# Altium project PulseOx_0.PrjPcb
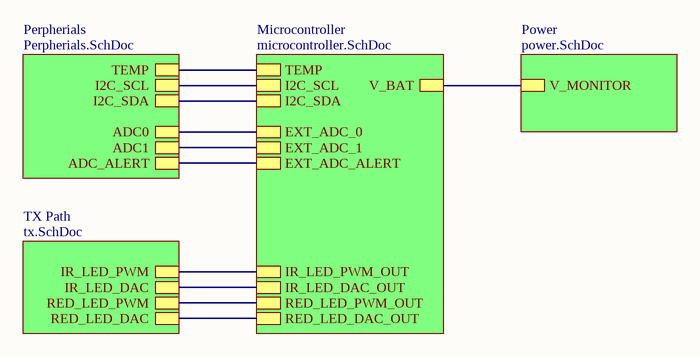
[diagram p0: TopLevel.SchDoc]
5 sheets, 63 parts. Net scope: hierarchical (ports join the sheet entries above them; power ports are global).
Board file: PulseOx_0_PCB.PcbDoc
Sheets:
  TopLevel.SchDoc
    Microcontroller = microcontroller.SchDoc
    Perpherials = Perpherials.SchDoc
    Power = power.SchDoc
    TX Path = tx.SchDoc

## Sheet TopLevel.SchDoc: Top Sheet V0
size Letter; Organization: PulseOut COVID; Address1: By: C. Miller; Address2: By. N. Petrunyak; Address3: pulseoutcovid.com; DocumentNumber: 1; Revision: 0; SheetNumber: 1; SheetTotal: 5

### Sub-sheets
Microcontroller = microcontroller.SchDoc: TEMP, I2C_SCL, IR_LED_PWM_OUT, RED_LED_PWM_OUT, I2C_SDA, V_BAT, EXT_ADC_0, EXT_ADC_1, EXT_ADC_ALERT, IR_LED_DAC_OUT, RED_LED_DAC_OUT
Perpherials = Perpherials.SchDoc: TEMP, I2C_SCL, I2C_SDA, ADC0, ADC1, ADC_ALERT
Power = power.SchDoc: V_MONITOR
TX Path = tx.SchDoc: IR_LED_DAC, RED_LED_DAC, IR_LED_PWM, RED_LED_PWM

### Nets
IR_DAC_OUT: sheet Microcontroller/IR_LED_DAC_OUT, sheet TX Path/IR_LED_DAC
IR_PWM_OUT: sheet Microcontroller/IR_LED_PWM_OUT, sheet TX Path/IR_LED_PWM
RED_DAC_OUT: sheet Microcontroller/RED_LED_DAC_OUT, sheet TX Path/RED_LED_DAC
RED_PWM_OUT: sheet Microcontroller/RED_LED_PWM_OUT, sheet TX Path/RED_LED_PWM
NetC15_2: sheet Microcontroller/TEMP, sheet Perpherials/TEMP
NetR2_1: sheet Microcontroller/EXT_ADC_0, sheet Perpherials/ADC0
NetR6_1: sheet Microcontroller/EXT_ADC_1, sheet Perpherials/ADC1
NetR22_2: sheet Microcontroller/EXT_ADC_ALERT, sheet Perpherials/ADC_ALERT
NetR23_2: sheet Microcontroller/I2C_SDA, sheet Perpherials/I2C_SDA
NetR24_2: sheet Microcontroller/I2C_SCL, sheet Perpherials/I2C_SCL
NetU1_4: sheet Microcontroller/V_BAT, sheet Power/V_MONITOR

### Notes on the sheet
- Title
- Size:
- Date:
- Letter
- Number:
- Time:
- Revision:
- Sheet
- of
- File:

## Sheet microcontroller.SchDoc: Microcontroller, Indicator, and RX
size Letter; Organization: PulseOut COVID; Address1: By: C. Miller; Address2: pulseoutcovid.com; DocumentNumber: 1; Revision: 0; SheetNumber: 2; SheetTotal: 5
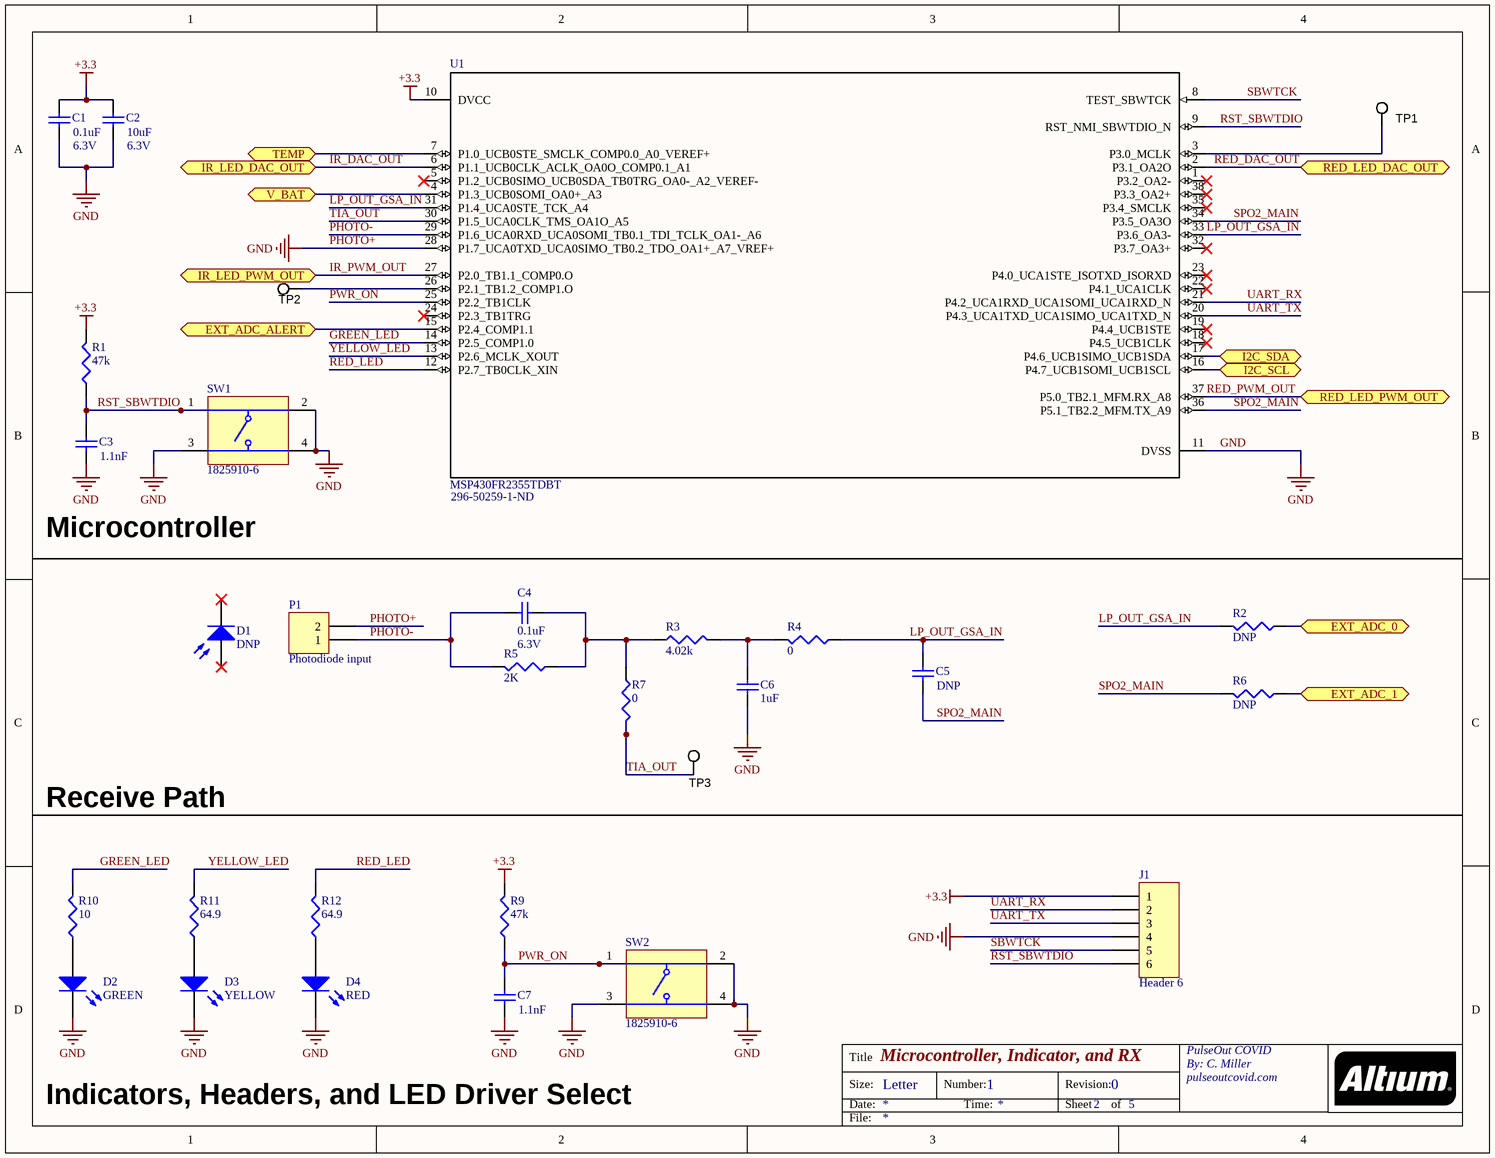
[diagram p1: microcontroller.SchDoc]

### Parts
C1  value 0.1uF  Voltage: 6.3V  [1608[0603]]  (hidden comment: Cap Semi)
C2  value 10uF  Voltage: 6.3V  [1608[0603]]  (hidden comment: Cap Semi)
C3  value 1.1nF  [0603]  (hidden comment: Cap Semi)
C4  value 0.1uF  Voltage: 6.3V  [1608[0603]]  (hidden comment: Cap Semi)
C5  value DNP  [0603]  (hidden comment: Cap Semi)
C6  value 1uF  [1608[0603]]  (hidden comment: Cap Semi)
C7  value 1.1nF  [0603]  (hidden comment: Cap Semi)
D1  DNP  [PIN2]
D2  GREEN  [3.5X2.8X1.9]
D3  YELLOW  [3.5X2.8X1.9]
D4  RED  [3.5X2.8X1.9]
J1  Header 6  [HDR1X6]
P1  Photodiode input  [HDR1X2]
R1  value 47k  [J1-0603]  (hidden comment: Res3)
R2  value DNP  [J1-0603]  (hidden comment: Res3)
R3  value 4.02k  [J1-0603]  (hidden comment: Res3)
R4  value 0  [J1-0603]  (hidden comment: Res3)
R5  value 2K  [J1-0603]  (hidden comment: Res3)
R6  value DNP  [J1-0603]  (hidden comment: Res3)
R7  value 0  [J1-0603]  (hidden comment: Res3)
R9  value 47k  [J1-0603]  (hidden comment: Res3)
R10  value 10  [J1-0603]  (hidden comment: Res3)
R11  value 64.9  [J1-0603]  (hidden comment: Res3)
R12  value 64.9  [J1-0603]  (hidden comment: Res3)
SW1  1825910-6  [TECO-1825910-6_V]
SW2  1825910-6  [TECO-1825910-6_V]
TP1  5002  [Keystone5002]  (value not drawn)
TP2  5002  [Keystone5002]  (value not drawn)
TP3  5002  [Keystone5002]  (value not drawn)
U1  MSP430FR2355TDBT  DigiKey: 296-50259-1-ND  [DBT0038A_N]

### Ports
EXT_ADC_0 (bidir), EXT_ADC_1 (bidir), EXT_ADC_ALERT (bidir), I2C_SCL (bidir), I2C_SDA (bidir), IR_LED_DAC_OUT (bidir), IR_LED_PWM_OUT (bidir), RED_LED_DAC_OUT (bidir), RED_LED_PWM_OUT (bidir), TEMP (bidir), V_BAT (bidir)

### Nets
+3.3: C1.2 C2.2 J1.1 R1.2 R9.2 U1.10(DVCC)
GND: C1.1 C2.1 C3.1 C6.2 C7.1 D2.2(K) D3.2(K) D4.2(K) J1.4 P1.2 SW1.2 SW1.3 SW1.4 SW2.2 SW2.3 SW2.4 U1.11(DVSS) U1.28(P1.7_UCA0TXD_UCA0SIMO_TB0.2_TDO_OA1+_A7_VREF+)  [also labelled PHOTO+]
GREEN_LED: R10.2 U1.14(P2.5_COMP1.0)
IR_DAC_OUT: U1.6(P1.1_UCB0CLK_ACLK_OA0O_COMP0.1_A1) ; port IR_LED_DAC_OUT
IR_PWM_OUT: U1.27(P2.0_TB1.1_COMP0.O) ; port IR_LED_PWM_OUT
LP_OUT_GSA_IN: C5.2 R2.2 R4.1 U1.31(P1.4_UCA0STE_TCK_A4) U1.33(P3.6_OA3-)
PHOTO-: C4.2 P1.1 R5.2 U1.29(P1.6_UCA0RXD_UCA0SOMI_TB0.1_TDI_TCLK_OA1-_A6)
PWR_ON: C7.2 R9.1 SW2.1 U1.25(P2.2_TB1CLK)
RED_DAC_OUT: U1.2(P3.1_OA2O) ; port RED_LED_DAC_OUT
RED_LED: R12.2 U1.12(P2.7_TB0CLK_XIN)
RED_PWM_OUT: U1.37(P5.0_TB2.1_MFM.RX_A8) ; port RED_LED_PWM_OUT
RST_SBWTDIO: C3.2 J1.6 R1.1 SW1.1 U1.9(RST_NMI_SBWTDIO_N)
SBWTCK: J1.5 U1.8(TEST_SBWTCK)
SPO2_MAIN: C5.1 R6.2 U1.34(P3.5_OA3O) U1.36(P5.1_TB2.2_MFM.TX_A9)
TIA_OUT: R7.2 TP3.1 U1.30(P1.5_UCA0CLK_TMS_OA1O_A5)
UART_RX: J1.2 U1.21(P4.2_UCA1RXD_UCA1SOMI_UCA1RXD_N)
UART_TX: J1.3 U1.20(P4.3_UCA1TXD_UCA1SIMO_UCA1TXD_N)
YELLOW_LED: R11.2 U1.13(P2.6_MCLK_XOUT)
NetC4_1: C4.1 R3.1 R5.1 R7.1
NetC6_1: C6.1 R3.2 R4.2
NetC15_2: U1.7(P1.0_UCB0STE_SMCLK_COMP0.0_A0_VEREF+) ; port TEMP
NetD2_1: D2.1(A) R10.1
NetD3_1: D3.1(A) R11.1
NetD4_1: D4.1(A) R12.1
NetR2_1: R2.1 ; port EXT_ADC_0
NetR6_1: R6.1 ; port EXT_ADC_1
NetR22_2: U1.15(P2.4_COMP1.1) ; port EXT_ADC_ALERT
NetR23_2: U1.17(P4.6_UCB1SIMO_UCB1SDA) ; port I2C_SDA
NetR24_2: U1.16(P4.7_UCB1SOMI_UCB1SCL) ; port I2C_SCL
NetTP1_1: TP1.1 U1.3(P3.0_MCLK)
NetTP2_1: TP2.1 U1.26(P2.1_TB1.2_COMP1.O)
NetU1_4: U1.4(P1.3_UCB0SOMI_OA0+_A3) ; port V_BAT

Not connected (* = marked no-connect by the designer): D1 1(A)* 2(K)*; U1 1(P3.2_OA2-)* 5(P1.2_UCB0SIMO_UCB0SDA_TB0TRG_OA0-_A2_VEREF-)* 18(P4.5_UCB1CLK)* 19(P4.4_UCB1STE)* 22(P4.1_UCA1CLK)* 23(P4.0_UCA1STE_ISOTXD_ISORXD)* 24(P2.3_TB1TRG)* 32(P3.7_OA3+)* 35(P3.4_SMCLK)* 38(P3.3_OA2+)*

### Notes on the sheet
- Microcontroller
- Receive Path
- Indicators, Headers, and LED Driver Select
- Title
- Size:
- Date:
- Letter
- Number:
- Time:
- Revision:
- Sheet
- of
- File:

### Library data of the parts
C1 C4 = Cap Semi: Capacitor (Semiconductor SIM Model); MPN: 06036C104KAT4A; Manufacturer: AVX Corporation; Published: 8-Jun-2000; LatestRevisionDate: 29-May-2009; LatestRevisionNote: IPC-7351 Footprint Added.; PackageReference: C1206; Publisher: Altium Limited; PackageDescription: Chip Capacitor; DigiKey: 478-06036C104KAT4ACT-ND
C2 = Cap Semi: Capacitor (Semiconductor SIM Model); MPN: JMK107ABJ106KA-T; Manufacturer: Taiyo Yuden; Published: 8-Jun-2000; LatestRevisionDate: 29-May-2009; LatestRevisionNote: IPC-7351 Footprint Added.; PackageReference: C1206; Publisher: Altium Limited; PackageDescription: Chip Capacitor; DigiKey: 587-6012-1-ND
C3 C7 = Cap Semi: Capacitor (Semiconductor SIM Model); MPN: GRM1885C1H112JA01D; Manufacturer: Murata Electronics; Published: 8-Jun-2000; LatestRevisionDate: 29-May-2009; LatestRevisionNote: IPC-7351 Footprint Added.; PackageReference: C1206; Publisher: Altium Limited; PackageDescription: Chip Capacitor; DigiKey: 490-1452-1-ND
C5 = Cap Semi: Capacitor (Semiconductor SIM Model); Published: 8-Jun-2000; LatestRevisionDate: 29-May-2009; LatestRevisionNote: IPC-7351 Footprint Added.; PackageReference: C1206; Publisher: Altium Limited; PackageDescription: Chip Capacitor; DigiKey: DNP
C6 = Cap Semi: Capacitor (Semiconductor SIM Model); MPN: C0603X105J9RAC7867; Manufacturer: KEMET; Published: 8-Jun-2000; LatestRevisionDate: 29-May-2009; LatestRevisionNote: IPC-7351 Footprint Added.; PackageReference: C1206; Publisher: Altium Limited; PackageDescription: Chip Capacitor; DigiKey: 399-17700-1-ND
D1 = Photo Sen: Photosensitive Diode; MPN: BPW34; Manufacturer: OSRAM Opto Semiconductors Inc.; Published: 24-Mar-1999; LatestRevisionDate: 17-Jul-2002; LatestRevisionNote: Re-released for DXP Platform.; PackageReference: PIN2; Publisher: Altium Limited; DigiKey: 475-1070-ND
D2 = LED3: Typical BLUE SiC LED; MPN: 150141GS73100; Manufacturer: Wurth Elektronik; Published: 8-Jun-2000; LatestRevisionDate: 17-Dec-2003; LatestRevisionNote: PCB Footprint replaced.; DatasheetVersion: 16-Apr-2002; PackageVersion: 16-Apr-2002; PackageReference: 3.5X2.8X1.9; Publisher: Altium Limited; PackageDescription: SM LED; 2 C-Bend Leads; Body 3.5 x 2.8 x 1.9 mm, inc leads (LxWxH typ); DigiKey: 732-4997-1-ND
D3 = LED3: Typical BLUE SiC LED; MPN: SML-Z14YTT86C; Manufacturer: Rohm Semiconductor; Published: 8-Jun-2000; LatestRevisionDate: 17-Dec-2003; LatestRevisionNote: PCB Footprint replaced.; DatasheetVersion: 16-Apr-2002; PackageVersion: 16-Apr-2002; PackageReference: 3.5X2.8X1.9; Publisher: Altium Limited; PackageDescription: SM LED; 2 C-Bend Leads; Body 3.5 x 2.8 x 1.9 mm, inc leads (LxWxH typ); DigiKey: SML-Z14YTT86CCT-ND
D4 = LED3: Typical BLUE SiC LED; MPN: 150141RS73100; Manufacturer: Wurth Elektronik; Published: 8-Jun-2000; LatestRevisionDate: 17-Dec-2003; LatestRevisionNote: PCB Footprint replaced.; DatasheetVersion: 16-Apr-2002; PackageVersion: 16-Apr-2002; PackageReference: 3.5X2.8X1.9; Publisher: Altium Limited; PackageDescription: SM LED; 2 C-Bend Leads; Body 3.5 x 2.8 x 1.9 mm, inc leads (LxWxH typ); DigiKey: 732-5000-1-ND
J1 = Header 6: Header, 6-Pin; MPN: 800-10-006-10-001000; Manufacturer: Mill-Max Manufacturing; LatestRevisionDate: 17-Jul-2002; LatestRevisionNote: Re-released for DXP Platform.; Publisher: Altium Limited; DigiKey: ED7264-06-ND
P1 = Header 2: Header, 2-Pin; LatestRevisionDate: 17-Jul-2002; LatestRevisionNote: Re-released for DXP Platform.; Publisher: Altium Limited
R1 R9 = Res3: Resistor; MPN: RC0603JR-0747KL; Manufacturer: Yageo; Published: 8-Jun-2000; LatestRevisionDate: 29-May-2009; LatestRevisionNote: IPC-7351 Footprint Added.; PackageReference: J1-0603; Publisher: Altium Limited; PackageDescription: Chip Resistor; DigiKey: 311-47KGRCT-ND
R2 R6 = Res3: Resistor; Published: 8-Jun-2000; LatestRevisionDate: 29-May-2009; LatestRevisionNote: IPC-7351 Footprint Added.; PackageReference: J1-0603; Publisher: Altium Limited; PackageDescription: Chip Resistor; DigiKey: DNP
R3 = Res3: Resistor; MPN: RMCF0603FT4K02; Manufacturer: Stackpole Electronics; Published: 8-Jun-2000; LatestRevisionDate: 29-May-2009; LatestRevisionNote: IPC-7351 Footprint Added.; PackageReference: J1-0603; Publisher: Altium Limited; PackageDescription: Chip Resistor; DigiKey: RMCF0603FT4K02CT-ND
R4 R7 = Res3: Resistor; MPN: RC0603JR-070RL; Manufacturer: Yageo; Published: 8-Jun-2000; LatestRevisionDate: 29-May-2009; LatestRevisionNote: IPC-7351 Footprint Added.; PackageReference: J1-0603; Publisher: Altium Limited; PackageDescription: Chip Resistor; DigiKey: 311-0.0GRCT-ND
R5 = Res3: Resistor; MPN: RC0603FR-072KL; Manufacturer: Yageo; Published: 8-Jun-2000; LatestRevisionDate: 29-May-2009; LatestRevisionNote: IPC-7351 Footprint Added.; PackageReference: J1-0603; Publisher: Altium Limited; PackageDescription: Chip Resistor; DigiKey: 311-2.00KHRCT-ND
R10 = Res3: Resistor; MPN: RC0603FR-0710RL; Manufacturer: Yageo; Published: 8-Jun-2000; LatestRevisionDate: 29-May-2009; LatestRevisionNote: IPC-7351 Footprint Added.; PackageReference: J1-0603; Publisher: Altium Limited; PackageDescription: Chip Resistor; DigiKey: 311-10.0HRCT-ND
R11 R12 = Res3: Resistor; MPN: ERA-3AEB64R9V; Manufacturer: Panasonic; Published: 8-Jun-2000; LatestRevisionDate: 29-May-2009; LatestRevisionNote: IPC-7351 Footprint Added.; PackageReference: J1-0603; Publisher: Altium Limited; PackageDescription: Chip Resistor; DigiKey: P64.9DBCT-ND
SW1 SW2 = CMP-1684-00021-1: Tact Switch, SPST-NO, 0.05 A, -35 to 85 degC, 4-Pin THD, RoHS, Bulk; Manufacturer: TE Connectivity; Maximum Contact Resistance: 100mOhm; Mechanical Life: 100000Cycles; Bushing Type: Unthreaded; Switch Configuration: OFF(ON); Maximum DC Voltage Rating: 24V; Contact Rating @ Voltage: 0.05A@24VDC; Actuator Color: Black; Body Orientation: Straight; Function: MomentaryContact; Illumination: N/R; Actuator Style: RoundButton; Actuator Material: PolybutyleneTerephthalate; Dielectric Strength: 500VAC; Pole Throw Configuration: SPST; Actuator Length: 1.4mm; Product Weight: N/A; Contact Material: CopperAlloy; Housing Material: N/A; Terminal Type: PCPins; Minimum Insulation Resistance: 100MOhm; Package Description: 4-Pin Through Hole Device, Body 5.99 x 5.99 mm, Pitch 6.5 mm; Part No: 1825910-6; Package Reference: THD; Base Material: N/A; Manufacturer URL: http://www.te.com; Contact Plating: Silver; RoHS: Yes; Datasheet Version: Rev. C9; Electrical Life: 100000Cycles; Maximum AC Voltage Rating: N/A; Thread Size: N/R; Operating Temperature: -35to85C; Mounting: ThroughHole; Dimension: 5.99x5mm; Datasheet URL: http://www.te.com/commerce/DocumentDelivery/DDEController?Action=showdoc&DocId=Customer+Drawing%7F1825910%7FC9%7Fpdf%7FEnglish%7FENG_CD_1825910_C9.pdf%7F1825910-6; Family: 1825910; Seal Location: N/A; Seal Description: N/A; Packaging: N/A; DigiKey: 450-1650-ND; MPN: 1825910-6
TP1-TP3 = 5002: Test Point, Miniature, White, TH; Manufacturer: Keystone; CompType: Test Point Loop; U/M: EA; SymbolVersion: 2008-04-04; PartNumber: 5002; PackageReference: White Miniature Testpoint; RoHS: Y; MountType: TH; ComponentLink1Description: Datasheet Link; ComponentLink1URL: http://www.keyelco.com/userAssets/file/M60-2p60.pdf; Value: White; Publisher: Texas Instruments; LatestRevisionDate: 2015-08-25; Supplier 1: Digi-Key; DigiKey: 36-5002-ND; Supplier 2: Newark; Supplier Part Number 2: 82H9632; MPN: 5002
U1 = MSP430FR2355TDBT: MSP430 IC; Manufacturer: Texas Instruments; PartNumber: MSP430FR2355IDBT; MPN: MSP430FR2355TDBTR; RefDes: RefDes; Type: DEV; Value: Value; Copyright: Copyright (C) 2018 Accelerated Designs. All rights reserved; Supplier 1: Digi-Key; Supplier Part Number 1: 296-50259-1-ND

## Sheet Perpherials.SchDoc: Perpherials
size Letter; Organization: PulseOut COVID; Address1: By: C. Miller; Address2: pulseoutcovid.com; DocumentNumber: 1; Revision: 0; SheetNumber: 5; SheetTotal: 5
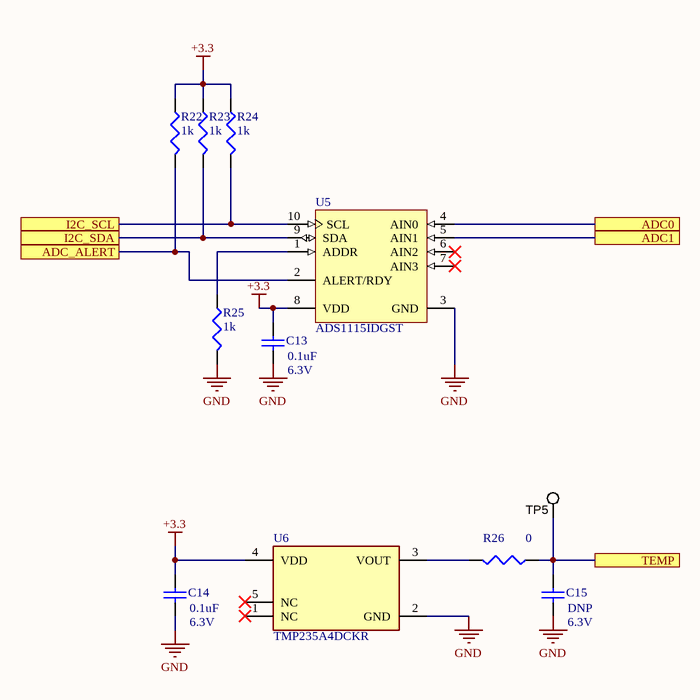
[diagram p2: Perpherials.SchDoc]

### Parts
C13  value 0.1uF  Voltage: 6.3V  [1608[0603]]  (hidden comment: Cap Semi)
C14  value 0.1uF  Voltage: 6.3V  [1608[0603]]  (hidden comment: Cap Semi)
C15  value DNP  Voltage: 6.3V  [1608[0603]]  (hidden comment: Cap Semi)
R22  value 1k  [J1-0603]  (hidden comment: Res3)
R23  value 1k  [J1-0603]  (hidden comment: Res3)
R24  value 1k  [J1-0603]  (hidden comment: Res3)
R25  value 1k  [J1-0603]  (hidden comment: Res3)
R26  value 0  [J1-0603]  (hidden comment: Res3)
TP5  5002  [Keystone5002]  (value not drawn)
U5  ADS1115IDGST  [TI-DGS10_M]
U6  TMP235A4DCKR  [FP-DCK0005A-MFG]

### Ports
ADC0, ADC1, ADC_ALERT, I2C_SCL, I2C_SDA, TEMP

### Nets
+3.3: C13.2 C14.2 R22.1 R23.1 R24.1 U5.8(VDD) U6.4(VDD)
GND: C13.1 C14.1 C15.1 R25.2 U5.3(GND) U6.2(GND)
NetC15_2: C15.2 R26.1 TP5.1 ; port TEMP
NetR2_1: U5.4(AIN0) ; port ADC0
NetR6_1: U5.5(AIN1) ; port ADC1
NetR22_2: R22.2 U5.2(ALERT/RDY) ; port ADC_ALERT
NetR23_2: R23.2 U5.9(SDA) ; port I2C_SDA
NetR24_2: R24.2 U5.10(SCL) ; port I2C_SCL
NetR25_1: R25.1 U5.1(ADDR)
NetR26_2: R26.2 U6.3(VOUT)

Not connected (* = marked no-connect by the designer): U5 6(AIN2)* 7(AIN3)*; U6 1(NC)* 5(NC)*

### Notes on the sheet
- Title
- Size:
- Date:
- Letter
- Number:
- Time:
- Revision:
- Sheet
- of
- File:

### Library data of the parts
C13 C14 = Cap Semi: as C1 on sheet microcontroller; Published: 8-Jun-2000; LatestRevisionDate: 29-May-2009; LatestRevisionNote: IPC-7351 Footprint Added.; PackageReference: C1206; Publisher: Altium Limited; PackageDescription: Chip Capacitor; DigiKey: 478-06036C104KAT4ACT-ND
C15 = Cap Semi: Capacitor (Semiconductor SIM Model); Published: 8-Jun-2000; LatestRevisionDate: 29-May-2009; LatestRevisionNote: IPC-7351 Footprint Added.; PackageReference: C1206; Publisher: Altium Limited; PackageDescription: Chip Capacitor; DigiKey: DNP
R22-R25 = Res3: Resistor; MPN: RC0603FR-071KL; Manufacturer: Yageo; Published: 8-Jun-2000; LatestRevisionDate: 29-May-2009; LatestRevisionNote: IPC-7351 Footprint Added.; PackageReference: J1-0603; Publisher: Altium Limited; PackageDescription: Chip Resistor; DigiKey: 311-1.00KHRCT-ND
R26 = Res3: as R4 on sheet microcontroller; Published: 8-Jun-2000; LatestRevisionDate: 29-May-2009; LatestRevisionNote: IPC-7351 Footprint Added.; PackageReference: J1-0603; Publisher: Altium Limited; PackageDescription: Chip Resistor; DigiKey: 311-0.0GRCT-ND
TP5 = 5002: as TP1 on sheet microcontroller; SymbolVersion: 2008-04-04; PartNumber: 5002; PackageReference: White Miniature Testpoint; RoHS: Y; MountType: TH; ComponentLink1Description: Datasheet Link; ComponentLink1URL: http://www.keyelco.com/userAssets/file/M60-2p60.pdf; Value: White; Publisher: Texas Instruments; LatestRevisionDate: 2015-08-25; Supplier 1: Digi-Key; DigiKey: 36-5002-ND; Supplier 2: Newark; Supplier Part Number 2: 82H9632; MPN: 5002
U5 = CMP-0003-00378-2: 16-Bit ADC with Integrated Multiplexer, PGA, Comparator, Oscillator, and Reference, -40 to 125 degC, 10-pin SOP (DGS10), Green (RoHS & no Sb/Br); Manufacturer: Texas Instruments; MPN: ADS1115IDGSR; Sample Rate (max)(SPS): 860; SubFamily: Precision ADC (<=10MSPS); Architecture: Delta-Sigma; Digital Supply(Min)(V): 2; Resolution(Bits): 16; Digital Supply(Max)(V): 5.5; INL(Max)(+/-LSB): 1; Interface: Serial I2C; # Input Channels: 4; Eco-Plan: Green (RoHS & no Sb/Br); PackageDescription: 10-Pin Plastic Small Outline, Body 3 x 3 mm, Pitch 0.5 mm; Mounting Technology: Surface Mount; PackageReference: DGS10; DatasheetVersion: SBAS444B; ComponentLink3Description: Package Specification; ComponentLink1Description: Manufacturer URL; PartNumber: ADS1115IDGST; ComponentLink3URL: http://www.ti.com/lit/ml/mpds035b/mpds035b.pdf; ComponentLink2URL: http://www.ti.com/general/docs/lit/getliterature.tsp?genericPartNumber=ADS1115&fileType=pdf; Analog Voltage AV/DD(Min)(V): 2; ComponentLink2Description: Datasheet; PackageVersion: 4073272/C, 02/2004; Analog Voltage AV/DD(Max)(V): 5.5; Code_JEDEC: MO-153; ComponentLink1URL: http://www.ti.com/; DigiKey: 296-38849-1-ND
U6 = CMP-04948-000022-1: SENSOR ANALOG -40C-150C SC70-5; Manufacturer: Texas Instruments; Max Junction Temp: +150°C; Output Current: 500uA; Standoff Height: 0mm; Output Voltage: 100-2000mV; Operating Supply Current: 9-10uA; Min Supply Voltage: 2.3V; Sensor Output: Analog Voltage; Max Supply Voltage: 5.5V; Ambient Temperature Range High: +150°C; Manufacturer Part Number: TMP235A4DCKR; Temperature Range Low: -40°C; Temperature Range High: +150°C; Lead Free: Yes; Mouser Description: ±2.5°C Analog output temperature sensor, with 10mV /°C gain 5-SC70 -40 to 150; Height: 1.1mm; ComponentLink2Description: Datasheet; ComponentLink2URL: https://www.ti.com/lit/ds/symlink/tmp235.pdf; Device Class L1: Sensors; Ambient Temperature Range Low: -40°C; Temperature: -40°C to +150°C; Device Class L2: Temperature and Humidity Sensors; Category: IC; Digikey Description: SENSOR ANALOG -40C-150C SC70-5; Automotive: No; RoHS: TRUE; Device Class L3: unset; Package: DCK0005A; Octopart: https://octopart.com/tmp235a4dckr-texas+instruments-88184449; MPN: TMP235A4DCKR; DigiKey: 296-50016-1-ND

## Sheet power.SchDoc: Power
size Letter; Organization: PulseOut COVID; Address1: By: N. Petrunyak; Address2: pulseoutcovid.com; DocumentNumber: 1; Revision: 0; SheetNumber: 4; SheetTotal: 5
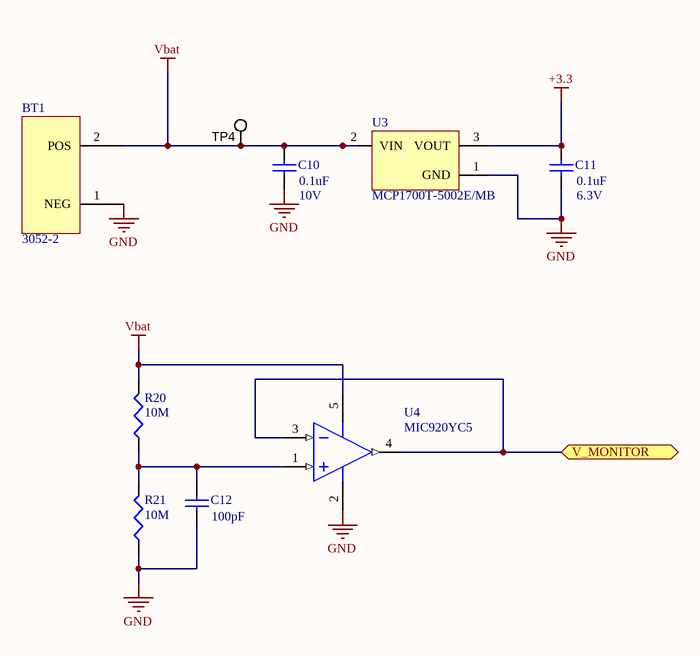
[diagram p3: power.SchDoc]

### Parts
BT1  3052-2  [3025-2]
C10  value 0.1uF  Voltage: 10V  [1608[0603]]  (hidden comment: Cap Semi)
C11  value 0.1uF  Voltage: 6.3V  [1608[0603]]  (hidden comment: Cap Semi)
C12  value 100pF  [0603]  (hidden comment: Cap Semi)
R20  value 10M  [J1-0603]  (hidden comment: Res3)
R21  value 10M  [J1-0603]  (hidden comment: Res3)
TP4  5002  [Keystone5002]  (value not drawn)
U3  MCP1700T-5002E/MB  [SOT-89-MB3_N]
U4  MIC920YC5  [X5+1_L]

### Ports
V_MONITOR (bidir)

### Nets
+3.3: C11.2 U3.3(VOUT)
GND: BT1.1(NEG) C10.1 C11.1 C12.1 R21.1 U3.1(GND) U4.2(VSS)
Vbat: BT1.2(POS) C10.2 R20.2 TP4.1 U3.2(VIN) U4.5(VDD)
NetC12_2: C12.2 R20.1 R21.2 U4.1(IN+)
NetU1_4: U4.3(IN-) U4.4(OUT) ; port V_MONITOR

### Notes on the sheet
- Title
- Size:
- Date:
- Letter
- Number:
- Time:
- Revision:
- Sheet
- of
- File:

### Library data of the parts
BT1 = 3025-2: BATTERY RETNR COIN 2 CELL PC PIN; Mfr 1: Keystone Electronics; Mfr 1 PN: 3025-2; DigiKey: 36-3025-2-ND; MPN: 3025-2; Manufacturer: Keystone Electronics
C10 = Cap Semi: Capacitor (Semiconductor SIM Model); MPN: 0603ZC104KAT2A; Manufacturer: AVX Corporation; Published: 8-Jun-2000; LatestRevisionDate: 29-May-2009; LatestRevisionNote: IPC-7351 Footprint Added.; PackageReference: C1206; Publisher: Altium Limited; PackageDescription: Chip Capacitor; DigiKey: 478-7939-6-ND
C11 = Cap Semi: as C1 on sheet microcontroller; Published: 8-Jun-2000; LatestRevisionDate: 29-May-2009; LatestRevisionNote: IPC-7351 Footprint Added.; PackageReference: C1206; Publisher: Altium Limited; PackageDescription: Chip Capacitor; DigiKey: 478-06036C104KAT4ACT-ND
C12 = Cap Semi: Capacitor (Semiconductor SIM Model); MPN: 0603ZC101KAT2A; Manufacturer: AVX Corporation; Published: 8-Jun-2000; LatestRevisionDate: 29-May-2009; LatestRevisionNote: IPC-7351 Footprint Added.; PackageReference: 0603; Publisher: Altium Limited; PackageDescription: Chip Capacitor; DigiKey: 478-11846-1-ND
R20 R21 = Res3: Resistor; MPN: ERJ-3GEYJ106V; Manufacturer: Panasonic; Published: 8-Jun-2000; LatestRevisionDate: 29-May-2009; LatestRevisionNote: IPC-7351 Footprint Added.; PackageReference: J1-0603; Publisher: Altium Limited; PackageDescription: Chip Resistor; DigiKey: P10MGCT-ND
TP4 = 5002: as TP1 on sheet microcontroller; SymbolVersion: 2008-04-04; PartNumber: 5002; PackageReference: White Miniature Testpoint; RoHS: Y; MountType: TH; ComponentLink1Description: Datasheet Link; ComponentLink1URL: http://www.keyelco.com/userAssets/file/M60-2p60.pdf; Value: White; Publisher: Texas Instruments; LatestRevisionDate: 2015-08-25; Supplier 1: Digi-Key; DigiKey: 36-5002-ND; Supplier 2: Newark; Supplier Part Number 2: 82H9632; MPN: 5002
U3 = CMP-0136-00868-1: Low Quiescent Current LDO, 3-Pin SOT-89, Extended Temperature, Tape and Reel; Manufacturer: Microchip; PackageDescription: 3-Lead Plastic Small Outline Transistor Header (MB) [SOT-89]; Code_IPC: SOT89; DatasheetVersion: revB, Feb-2007; PackageVersion: revBB, Aug-2009; PackageReference: SOT-89-MB3; DigiKey: MCP1700T5002EMBCT-ND; MPN: MCP1700T-5002E/MB
U4 = CMP-0252-00510-1: High-Output-Drive, Rail-to-Rail I/O Op Amps with Shutdown, 10 MHz, 10 V/us, 2.7 to 5.5 V, -40 to 125 degC, 5-Pin SC70 (X5+1), RoHS, Tape and Reel; Manufacturer: Microchip; PartNumber: MIC920YC5-TR; Gain Bandwidth: 80 MHz Typ.; VDD: 2.5 to 9 V; ComponentLink2URL: http://ww1.microchip.com/downloads/en/DeviceDoc/MIC920-80MHz-Low-Power-SC70-Op-Amp-DS20006268A.pdf; RoHS: TRUE; Packing: Tape and Reel; Mounting Technology: Surface Mount; Temperature Range: -40 to 125 degC; ComponentLink2Description: Datasheet; DigiKey: 576-4560-1-ND; MPN: MIC920YC5-TR

## Sheet tx.SchDoc: Transmit Path
size Letter; Organization: PulseOut COVID; Address1: By: N. Petrunyak; Address2: pulseoutcovid.com; DocumentNumber: 0; Revision: 0; SheetNumber: 3; SheetTotal: 5
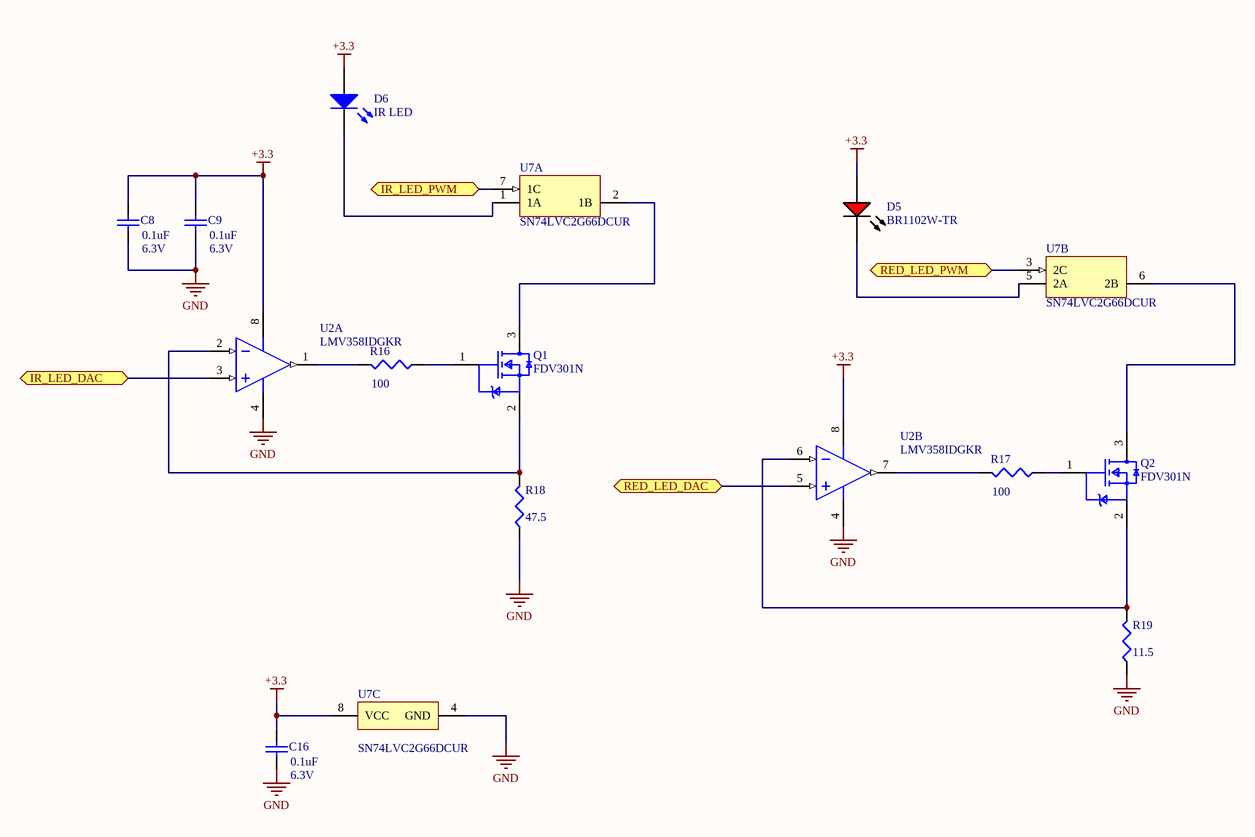
[diagram p4: tx.SchDoc]

### Parts
C8  value 0.1uF  Voltage: 6.3V  [1608[0603]]  (hidden comment: Cap Semi)
C9  value 0.1uF  Voltage: 6.3V  [1608[0603]]  (hidden comment: Cap Semi)
C16  value 0.1uF  Voltage: 6.3V  [1608[0603]]  (hidden comment: Cap Semi)
D5  BR1102W-TR  [STEC-1102W_V]
D6  IR LED  [1206_180]
Q1  FDV301N  [FP-318-08-MFG]
Q2  FDV301N  [FP-318-08-MFG]
R16  value 100  [J1-0603]  (hidden comment: Res3)
R17  value 100  [J1-0603]  (hidden comment: Res3)
R18  47.5  [J1-0603]
R19  11.5  [J1-0603]
U2  LMV358IDGKR  [DGK0008A_M]  (parts A,B of 2)
U7  SN74LVC2G66DCUR  [DCU0008A_M]  (parts A,B,C of 3)

### Ports
IR_LED_DAC (bidir), IR_LED_PWM (bidir), RED_LED_DAC (bidir), RED_LED_PWM (bidir)

### Nets
+3.3: C8.2 C9.2 C16.2 D5.1(A) D6.1(A) U2.8(VCC+) U7.8(VCC)
GND: C8.1 C9.1 C16.1 R18.1 R19.1 U2.4(GND) U7.4(GND)
IR_DAC_OUT: U2.3(1IN+) ; port IR_LED_DAC
IR_PWM_OUT: U7.7(1C) ; port IR_LED_PWM
RED_DAC_OUT: U2.5(2IN+) ; port RED_LED_DAC
RED_PWM_OUT: U7.3(2C) ; port RED_LED_PWM
NetD5_2: D5.2(K) U7.5(2A)
NetD6_2: D6.2(K) U7.1(1A)
NetQ1_1: Q1.1(G) R16.1
NetQ1_2: Q1.2(S) R18.2 U2.2(1IN-)
NetQ1_3: Q1.3(D) U7.2(1B)
NetQ2_1: Q2.1(G) R17.1
NetQ2_2: Q2.2(S) R19.2 U2.6(2IN-)
NetQ2_3: Q2.3(D) U7.6(2B)
NetR16_2: R16.2 U2.1(1OUT)
NetR17_2: R17.2 U2.7(2OUT)

### Notes on the sheet
- Title
- Size:
- Date:
- Letter
- Number:
- Time:
- Revision:
- Sheet
- of
- File:

### Library data of the parts
C8 C9 C16 = Cap Semi: as C1 on sheet microcontroller; Published: 8-Jun-2000; LatestRevisionDate: 29-May-2009; LatestRevisionNote: IPC-7351 Footprint Added.; PackageReference: C1206; Publisher: Altium Limited; PackageDescription: Chip Capacitor; DigiKey: 478-06036C104KAT4ACT-ND
D5 = CMP-2000-05961-1: LED, Red, 647 nm, -30 to 85 degC, 2-Pin SMD, RoHS, Tape and Reel; Manufacturer: Stanley Electric; Rad Hardened: No; Number of  Elements: 1; Dominant Wave Length: 647nm; DELETED: Compliant; Product Depth (mm): 1.5mm; Chip Material: GaAlAs; Product Length (mm): 3mm; Power Dissipation: 60W; Peak Wavelength: 660nm; Luminous Intensity: 33.6mcd; Forward Current: 30mA; Forward Voltage: 2V; Viewing Angle: 70/82deg; Main Category: ChipLED; Test Current (It): 20mA; Reverse Voltage: 4V; Type: Uni-Color; Shape Type: Rectangular; Package Description: 2-Pin Surface Mounted Device , Body 3 x 1.5 mm; Pin Count: 2; Datasheet Version: 08/2007; Lens Dimensions: 2x1.5x0.9mm; Mounting Technology: SurfaceMount; Packaging: TapeandReel; Operating Temp Range: -30Cto85C; Product Height (mm): 1.5mm; Package Type: SMD; Emitting Color: Red; Datasheet URL: https://datasheet.ciiva.com/34302/1845603-34302809.pdf; Operating Temperature Classification: Commercial; Lum Intensity: 33.6mcd; Mounting: SurfaceMount; Manufacturer URL: http://www.stanley-electric.com/; High Brightness: No; Package Reference: 1102W; DigiKey: 404-1048-1-ND; MPN: BR1102W-TR
D6 = LED0: Typical INFRARED GaAs LED; MPN: IR26-21C/L110/TR8; Manufacturer: Everlight Electronics Co Ltd; Published: 8-Jun-2000; LatestRevisionDate: 08-Jul-2005; LatestRevisionNote: Mech Layer 1 removed.; PackageReference: LED-0; Publisher: Altium Limited; PackageDescription: LED; 2 Leads; DigiKey: 1080-1357-1-ND
Q1 Q2 = CMP-07173-000062-1: MOSFET N-CH 25V 220MA SOT-23; Manufacturer: ON Semiconductor; Turn Off Delay Time: 3.5ns; Typ Forward Diode Voltage: 0.8V; Max Junction Temp: +150°C; Threshold Vgs Max: 1.06V; Threshold Vgs Min: 0.7V; Standoff Height: 0.01mm; Max Forward Diode Voltage: 1.2V; Number Of Channels: 1; Rthja Max: 357°C/W; Drain To Source Resistance: 3.1Ω; Input Capacitace At Vds: 9.5pF @ 10V; Gate Charge At Vgs: 0.49nC @ 4.5V; Transconductance: 0.2S; Turn On Delay Time: 3.2ns; Depletion Mode: False; Power Dissipation: 0.35W; Continuous Drain Current: 0.22A; Gate To Source Voltage: 8V; RoHS: TRUE; Lead Free: Yes; Temperature Range High: +150°C; Automotive: No; Height: 1.11mm; Category: Trans; Mouser Description: MOSFET N-Ch Digital; Drain To Source Voltage: 25V; Temperature: -55°C to +150°C; Ipc Land Pattern Name: SOT95P240X100-3; Device Class L1: Discrete Semiconductors; Octopart: https://octopart.com/fdv301n-on+semiconductor-84326713; Footprint Url: https://www.onsemi.com/pub/Collateral/318-08.PDF; Digikey Description: MOSFET N-CH 25V 220MA SOT-23; Drain To Source Breakdown Voltage: 25V; Temperature Range Low: -55°C; Number Of N Channels: 1; Device Class L3: MOSFETs; Package: 318-08; ComponentLink2URL: https://www.onsemi.com/pub/Collateral/FDV301N-D.PDF; Manufacturer Part Number: FDV301N; Device Class L2: Transistors; ComponentLink2Description: Datasheet; DigiKey: FDV301NCT-ND; MPN: FDV301N
R16 R17 = Res3: Resistor; MPN: ERJ-PA3F1000V; Manufacturer: Panasonic; Published: 8-Jun-2000; LatestRevisionDate: 29-May-2009; LatestRevisionNote: IPC-7351 Footprint Added.; PackageReference: J1-0603; Publisher: Altium Limited; PackageDescription: Chip Resistor; DigiKey: P100BYCT-ND
R18 = Res3: Resistor; MPN: RC0603FR-0747R5L; Manufacturer: Yageo; Published: 8-Jun-2000; LatestRevisionDate: 29-May-2009; LatestRevisionNote: IPC-7351 Footprint Added.; PackageReference: J1-0603; Publisher: Altium Limited; PackageDescription: Chip Resistor; Value: 47.5; DigiKey: 311-47.5HRDKR-ND
R19 = Res3: Resistor; MPN: ERJ-3EKF11R5V; Manufacturer: Panasonic; Published: 8-Jun-2000; LatestRevisionDate: 29-May-2009; LatestRevisionNote: IPC-7351 Footprint Added.; PackageReference: J1-0603; Publisher: Altium Limited; PackageDescription: Chip Resistor; Value: 11.5; DigiKey: P11.5HCT-ND
U2 = CMP-2100-03651-1: Low-Voltage Rail-to-Rail Output Operational Amplifier, 2.7 to 5.5 V, -40 to 125 degC, 8-Pin VSSOP (DGK), Green (RoHS & no Sb/Br), Tape and Reel; Manufacturer: Texas Instruments; MPN: LMV358SG-13; Unity Gain Bandwidth Product: 1MHz; Common Mode Rejection Ratio: 50dB; Operating Supply Current: 210uA; Number of Circuits: 2; Input Offset Voltage (Vos): 7mV; Voltage Gain: 100dB; Supply Voltage: 5V; Nominal Supply Current: 440uA; Input Bias Current: 250nA; Min Supply Voltage: 2.7V; Max Supply Voltage: 5.5V; Slew Rate: 1V/us; Output Current per Channel: 160mA; Width: 3mm; Package Description: 8-Pin Thin Small Outline Package, Body 3 x 3 mm, Pitch 0.65 mm; Packaging: TapeandReel; REACH SVHC: NoSVHC; Number of Pins: 8; Length: 3mm; Lead Free: LeadFree; Height: 0.97mm; Package URL: http://www.ti.com/litv/pdf/mpds028d; Number of Channels: 2; Number of Elements: 2; Datasheet URL: http://www.ti.com/lit/ds/symlink/lmv358.pdf; Datasheet Version: SLOS263W, 10/2014; Case/Package: MSOP; Bandwidth: 1MHz; Gain Bandwidth Product: 1MHz; Number of Amplifiers: 2; Max Operating Temperature: 85degC; Mount: SurfaceMount; RoHSCompliant: true; Package Reference: DGK0008A; Min Operating Temperature: -40degC; Radiation Hardening: No; Contact Plating: Gold; Package Quantity: 1; Output Current: 160mA; Manufacturer URL: http://www.ti.com/; DigiKey: LMV358SG-13DICT-ND
U7 = CMP-0859-00645-3: Dual Analog Switch, DCU0008A, LARGE T&R; Manufacturer: Texas Instruments; 3-State Output: No; Rating: Catalog; Output Drive (IOL/IOH)(Max)(mA): 32/-32; Bits(#): 2; Output Type: CMOS; ICC @ Nom Voltage(Max)(mA): 0.01; Voltage(Nom)(V): 1.8,2.5,3.3,5; tpd @ Nom Voltage(Max)(ns): 2,1.2,0.8,0.6; Logic: True; VCC(Min)(V): 1.65; Technology Family: LVC; F @ Nom Voltage(Max)(Mhz): 150; Switch Configuration: SPST; VCC(Max)(V): 5.5; Sub-Family: Analog Switch; DatasheetVersion: SCES325K; Generic Part Number: SN74LVC2G66; PackageReference: DCU0008A; Channels(#): 2; Input Type: CMOS; Schmitt Trigger: No; Operating Temperature Range(C): -40 to 85; DigiKey: 296-13272-1-ND; MPN: SN74LVC2G66DCUR

## Nets that join several sheets
+3.3: microcontroller (6 pins), Perpherials (7 pins), power (C11.2 U3.3), tx (7 pins)
GND: microcontroller (18 pins), Perpherials (6 pins), power (7 pins), tx (7 pins)
IR_DAC_OUT: microcontroller (U1.6), tx (U2.3)
IR_PWM_OUT: microcontroller (U1.27), tx (U7.7)
NetC15_2: microcontroller (U1.7), Perpherials (C15.2 R26.1 TP5.1)
NetR2_1: microcontroller (R2.1), Perpherials (U5.4)
NetR6_1: microcontroller (R6.1), Perpherials (U5.5)
NetR22_2: microcontroller (U1.15), Perpherials (R22.2 U5.2)
NetR23_2: microcontroller (U1.17), Perpherials (R23.2 U5.9)
NetR24_2: microcontroller (U1.16), Perpherials (R24.2 U5.10)
NetU1_4: microcontroller (U1.4), power (U4.3 U4.4)
RED_DAC_OUT: microcontroller (U1.2), tx (U2.5)
RED_PWM_OUT: microcontroller (U1.37), tx (U7.3)